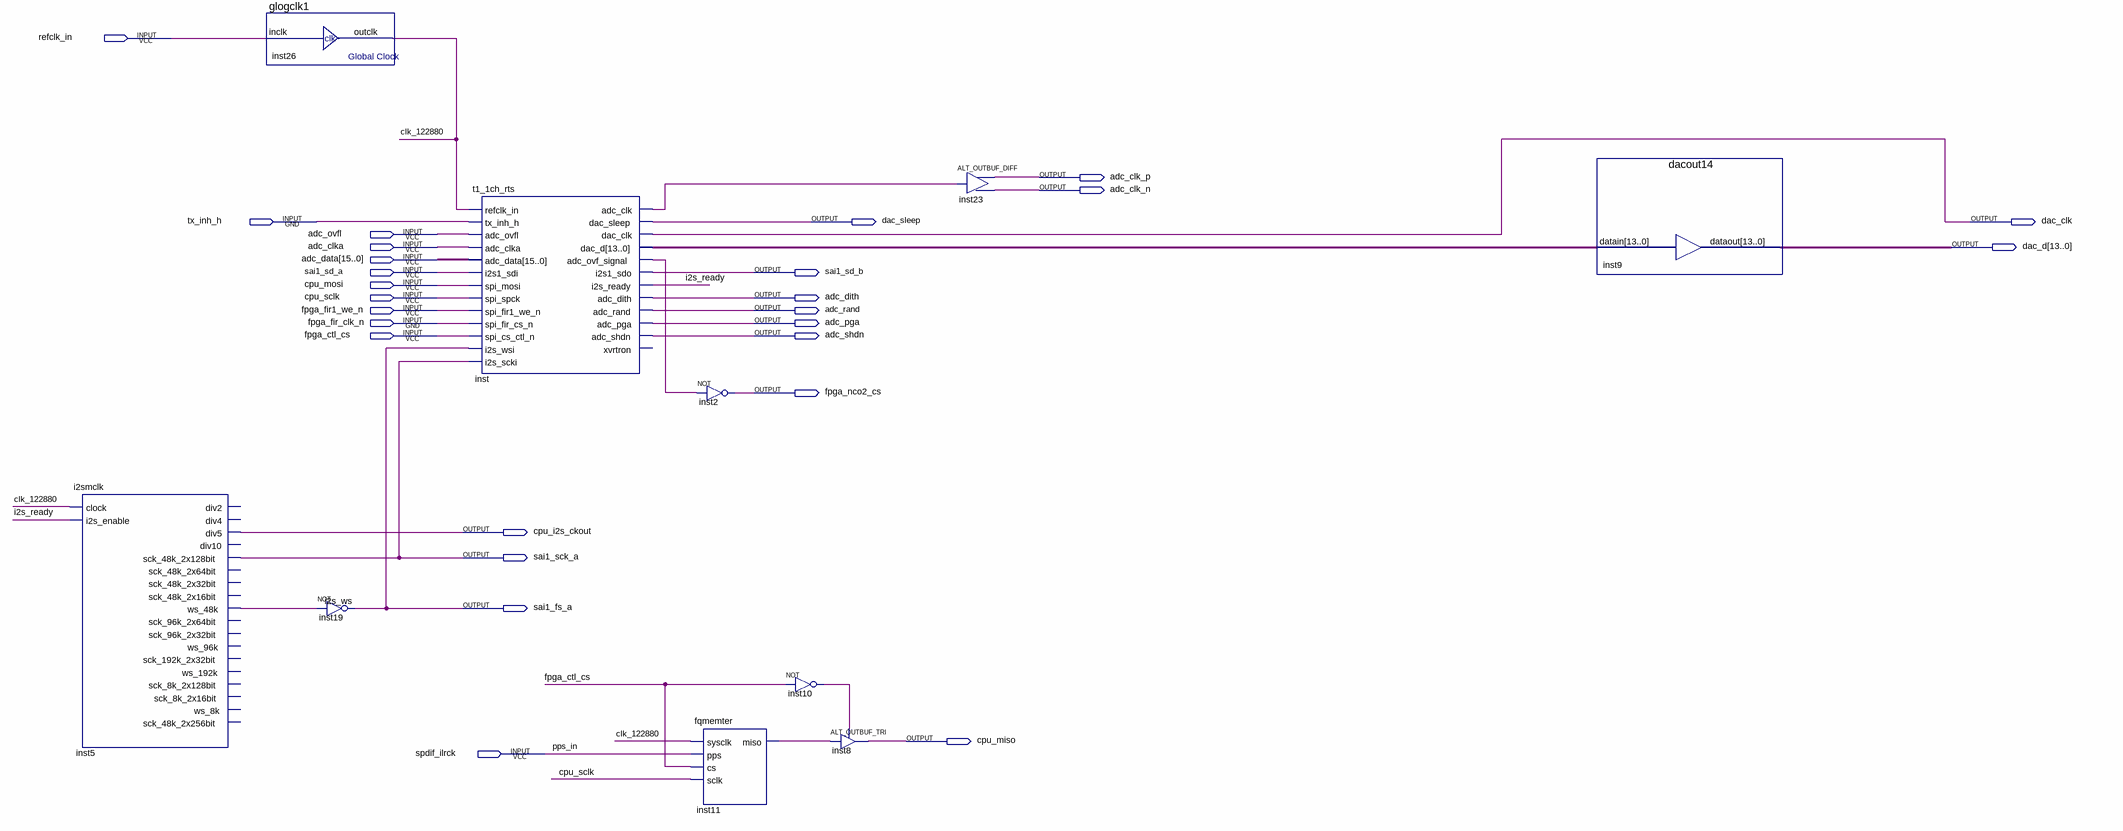
[diagram p0: schematic sheet]
// Quartus schematic tc1_top_v4.bdf as structural Verilog: 10 symbols, 27 pins
module tc1_top_v4 (
  input  refclk_in,
  input  tx_inh_h,
  input  adc_ovfl,
  input  adc_clka,
  input  [15:0] adc_data,
  input  sai1_sd_a,
  input  cpu_mosi,
  input  cpu_sclk,
  input  fpga_fir1_we_n,
  input  fpga_fir_clk_n,
  input  fpga_ctl_cs,
  input  spdif_ilrck,
  output adc_clk_p,
  output adc_clk_n,
  output dac_sleep,
  output dac_clk,
  output [13:0] dac_d,
  output sai1_sd_b,
  output adc_dith,
  output adc_rand,
  output adc_pga,
  output adc_shdn,
  output fpga_nco2_cs,
  output cpu_i2s_ckout,
  output sai1_sck_a,
  output sai1_fs_a,
  output cpu_miso
);

  wire clk_122880, i2s_ready, inst5_ws_48k, inst10_out, inst11_miso, inst_adc_clk, inst_adc_ovf_signal;
  wire [13:0] inst_dac_d;

  i2smclk inst5 (
    .clock(clk_122880), .i2s_enable(i2s_ready), .div5(cpu_i2s_ckout), .sck_48k_2x128bit(sai1_sck_a),
    .ws_48k(inst5_ws_48k));  // open: div2, div4, div10, sck_48k_2x64bit, sck_48k_2x32bit, sck_48k_2x16bit, sck_96k_2x64bit, sck_96k_2x32bit, ws_96k, sck_192k_2x32bit, ws_192k, sck_8k_2x128bit, sck_8k_2x16bit, ws_8k, sck_48k_2x256bit
  glogclk1 inst26 (.inclk(refclk_in), .outclk(clk_122880));
  not inst19 (sai1_fs_a, inst5_ws_48k);
  t1_1ch_rts inst (
    .refclk_in(clk_122880), .tx_inh_h(tx_inh_h), .adc_ovfl(adc_ovfl), .adc_clka(adc_clka),
    .adc_data(adc_data), .i2s1_sdi(sai1_sd_a), .spi_mosi(cpu_mosi), .spi_spck(cpu_sclk),
    .spi_fir1_we_n(fpga_fir1_we_n), .spi_fir_cs_n(fpga_fir_clk_n), .spi_cs_ctl_n(fpga_ctl_cs),
    .i2s_wsi(sai1_fs_a), .i2s_scki(sai1_sck_a), .adc_clk(inst_adc_clk), .dac_sleep(dac_sleep),
    .dac_clk(dac_clk), .dac_d(inst_dac_d), .adc_ovf_signal(inst_adc_ovf_signal), .i2s1_sdo(sai1_sd_b),
    .i2s_ready(i2s_ready), .adc_dith(adc_dith), .adc_rand(adc_rand), .adc_pga(adc_pga), .adc_shdn(adc_shdn));  // open: xvrtron
  not inst2 (fpga_nco2_cs, inst_adc_ovf_signal);
  fqmemter inst11 (.sysclk(clk_122880), .pps(spdif_ilrck), .cs(fpga_ctl_cs), .sclk(cpu_sclk), .miso(inst11_miso));
  not inst10 (inst10_out, fpga_ctl_cs);
  ALT_OUTBUF_TRI inst8 (.i(inst11_miso), .oe(inst10_out), .o(cpu_miso));
  ALT_OUTBUF_DIFF inst23 (.i(inst_adc_clk), .obar(adc_clk_n), .o(adc_clk_p));
  dacout14 inst9 (.datain(inst_dac_d), .dataout(dac_d));

  // Other names for the same wires on the sheet: i2s_ws = sai1_fs_a; pps_in = spdif_ilrck
endmodule
